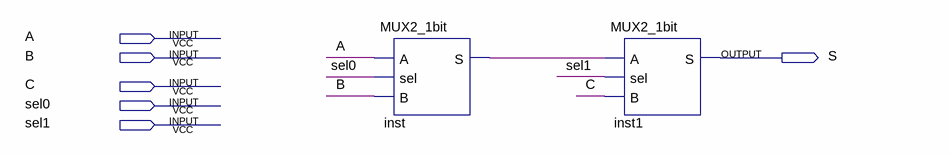
[diagram p0: schematic sheet]
// Quartus schematic MUX3_1bit.bdf as structural Verilog: 2 symbols, 6 pins
module MUX3_1bit (
  input  A,
  input  B,
  input  C,
  input  sel0,
  input  sel1,
  output S
);

  wire inst_s;

  MUX2_1bit inst (.A(A), .sel(sel0), .B(B), .S(inst_s));
  MUX2_1bit inst1 (.A(inst_s), .sel(sel1), .B(C), .S(S));
endmodule
